# EAGLE design ACC-MB-R0 (EAGLE 9.1.3)

## Sheet 1 of 6
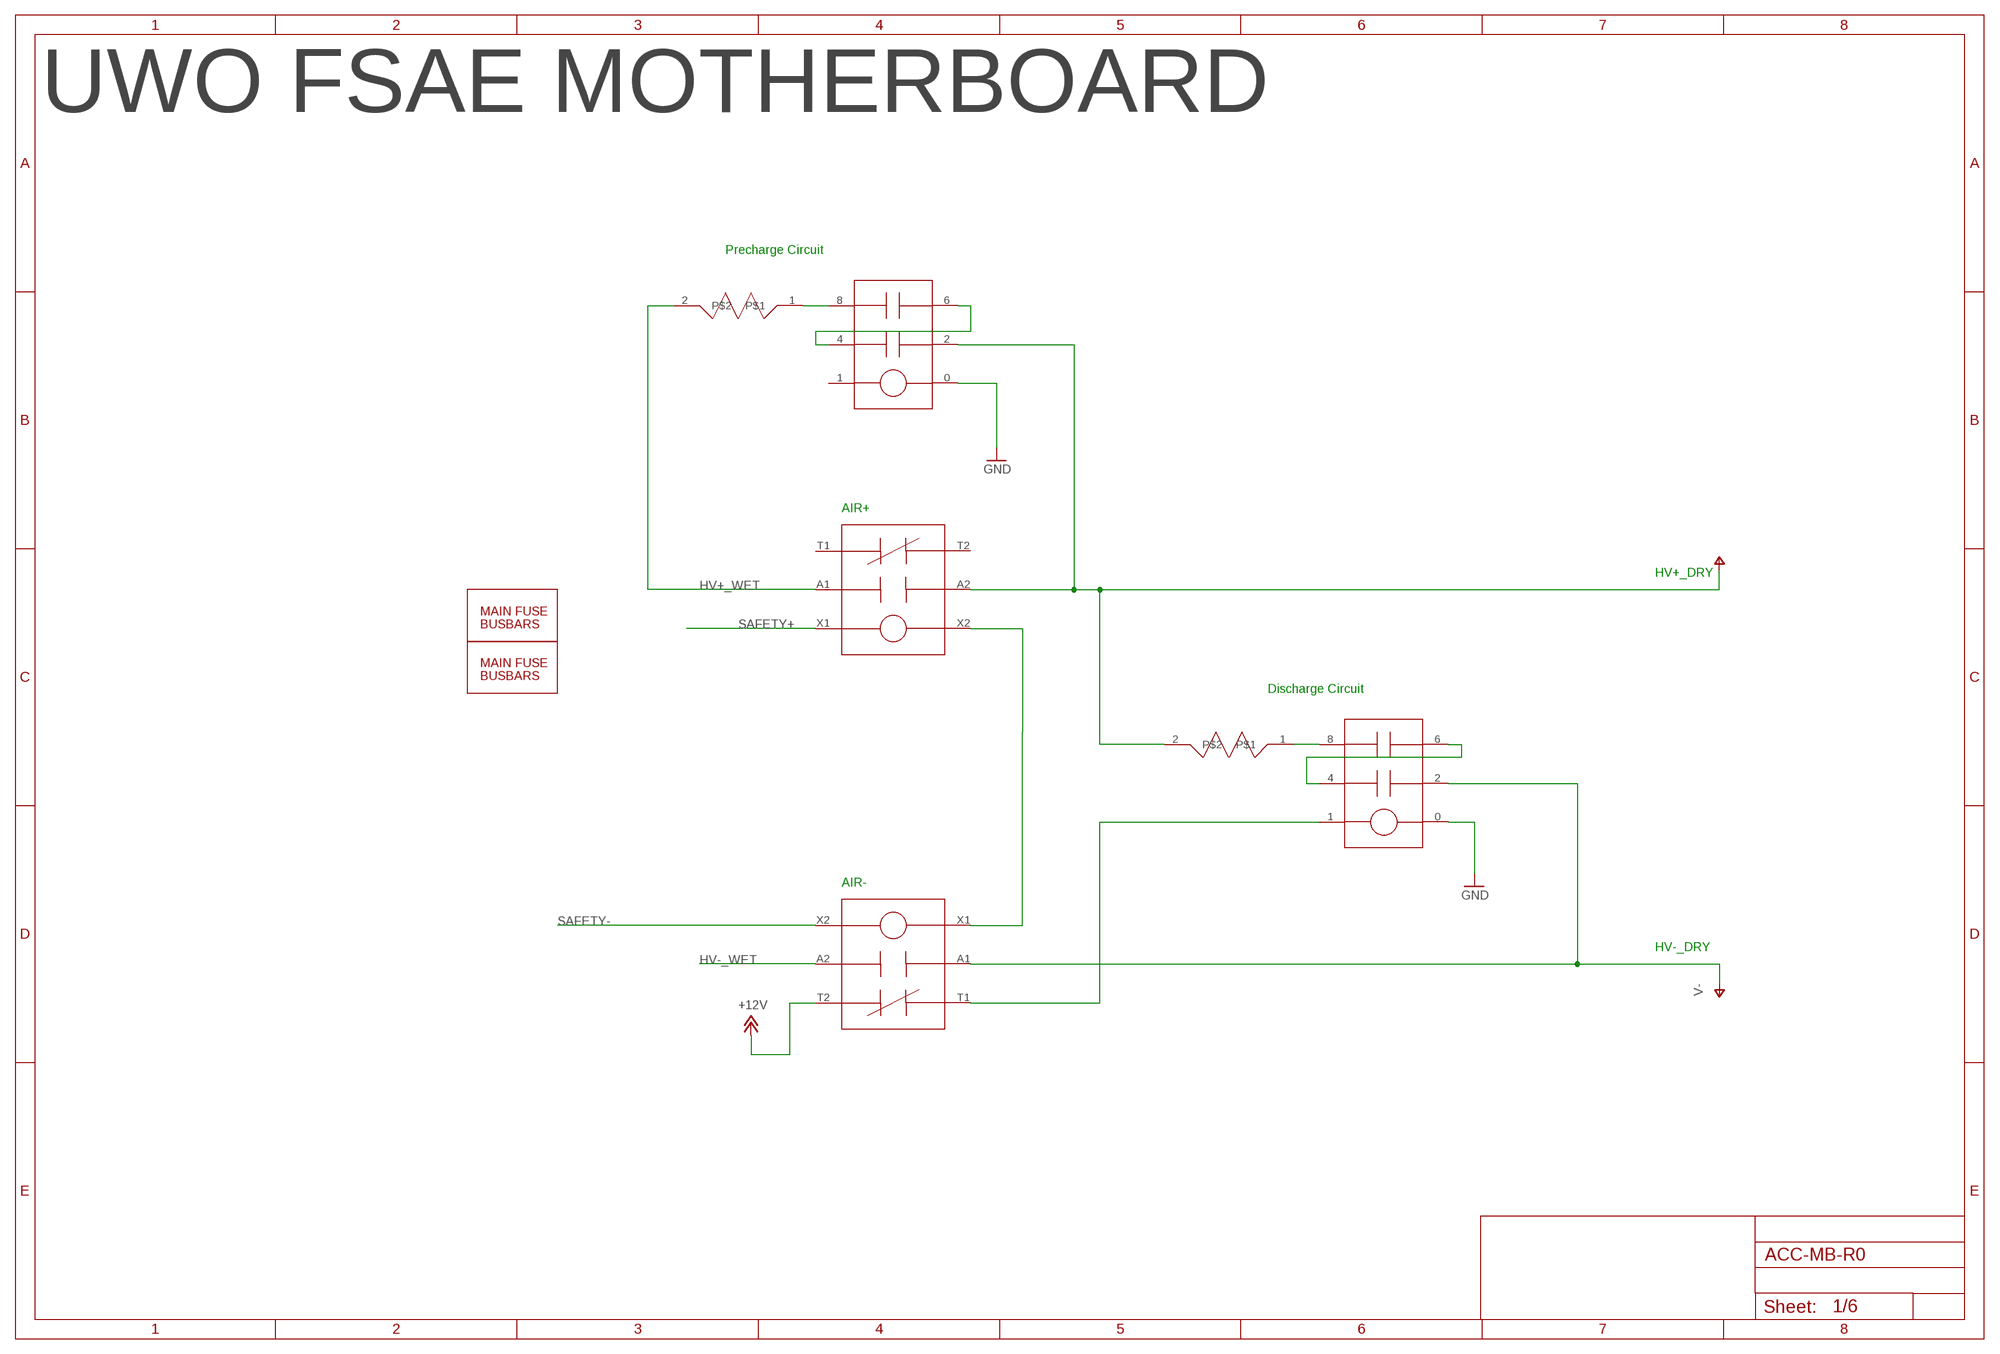
[diagram p0: schematic, sheet 1]

### Parts
U$1  G7L  [G7L]
U$4  TO247RESISTORHEATINK  [_CUSTOM_TO-247-2V]
U$24  FUSE_HOLDER  [FUSE_HOLDER]
U$31  GV224  [GV224]
U$32  GV224  [GV224]
U$33  FUSE_HOLDER  [FUSE_HOLDER]
U$34  G7L  [G7L]
U$35  TO247RESISTORHEATINK  [_CUSTOM_TO-247-2V]

### Nets
+12V: U$32.T2 ; also sheet 3,4,6
GND: U$1.0 U$34.0 ; also sheet 3,4,6
HV+_WET: U$31.A1 U$35.2
HV-_WET: U$32.A2
N$21: U$34.8 U$35.1
N$23: U$34.4 U$34.6
N$24: U$1.1 U$32.T1
N$27: U$31.X2 U$32.X1
N$30: U$1.4 U$1.6
N$31: U$1.8 U$4.1
SAFETY+: U$31.X1
SAFETY-: U$32.X2
V+ [LV]: U$4.2 U$31.A2 U$34.2 ; also sheet 3,4
V- [LV]: U$1.2 U$32.A1 ; also sheet 3,4
Unconnected: U$31.T1 U$31.T2 U$34.1

### Notes on the sheet
- UWO FSAE MOTHERBOARD
- Precharge Circuit
- AIR+
- HV+_DRY
- Discharge Circuit
- AIR-
- HV-_DRY

## Sheet 2 of 6
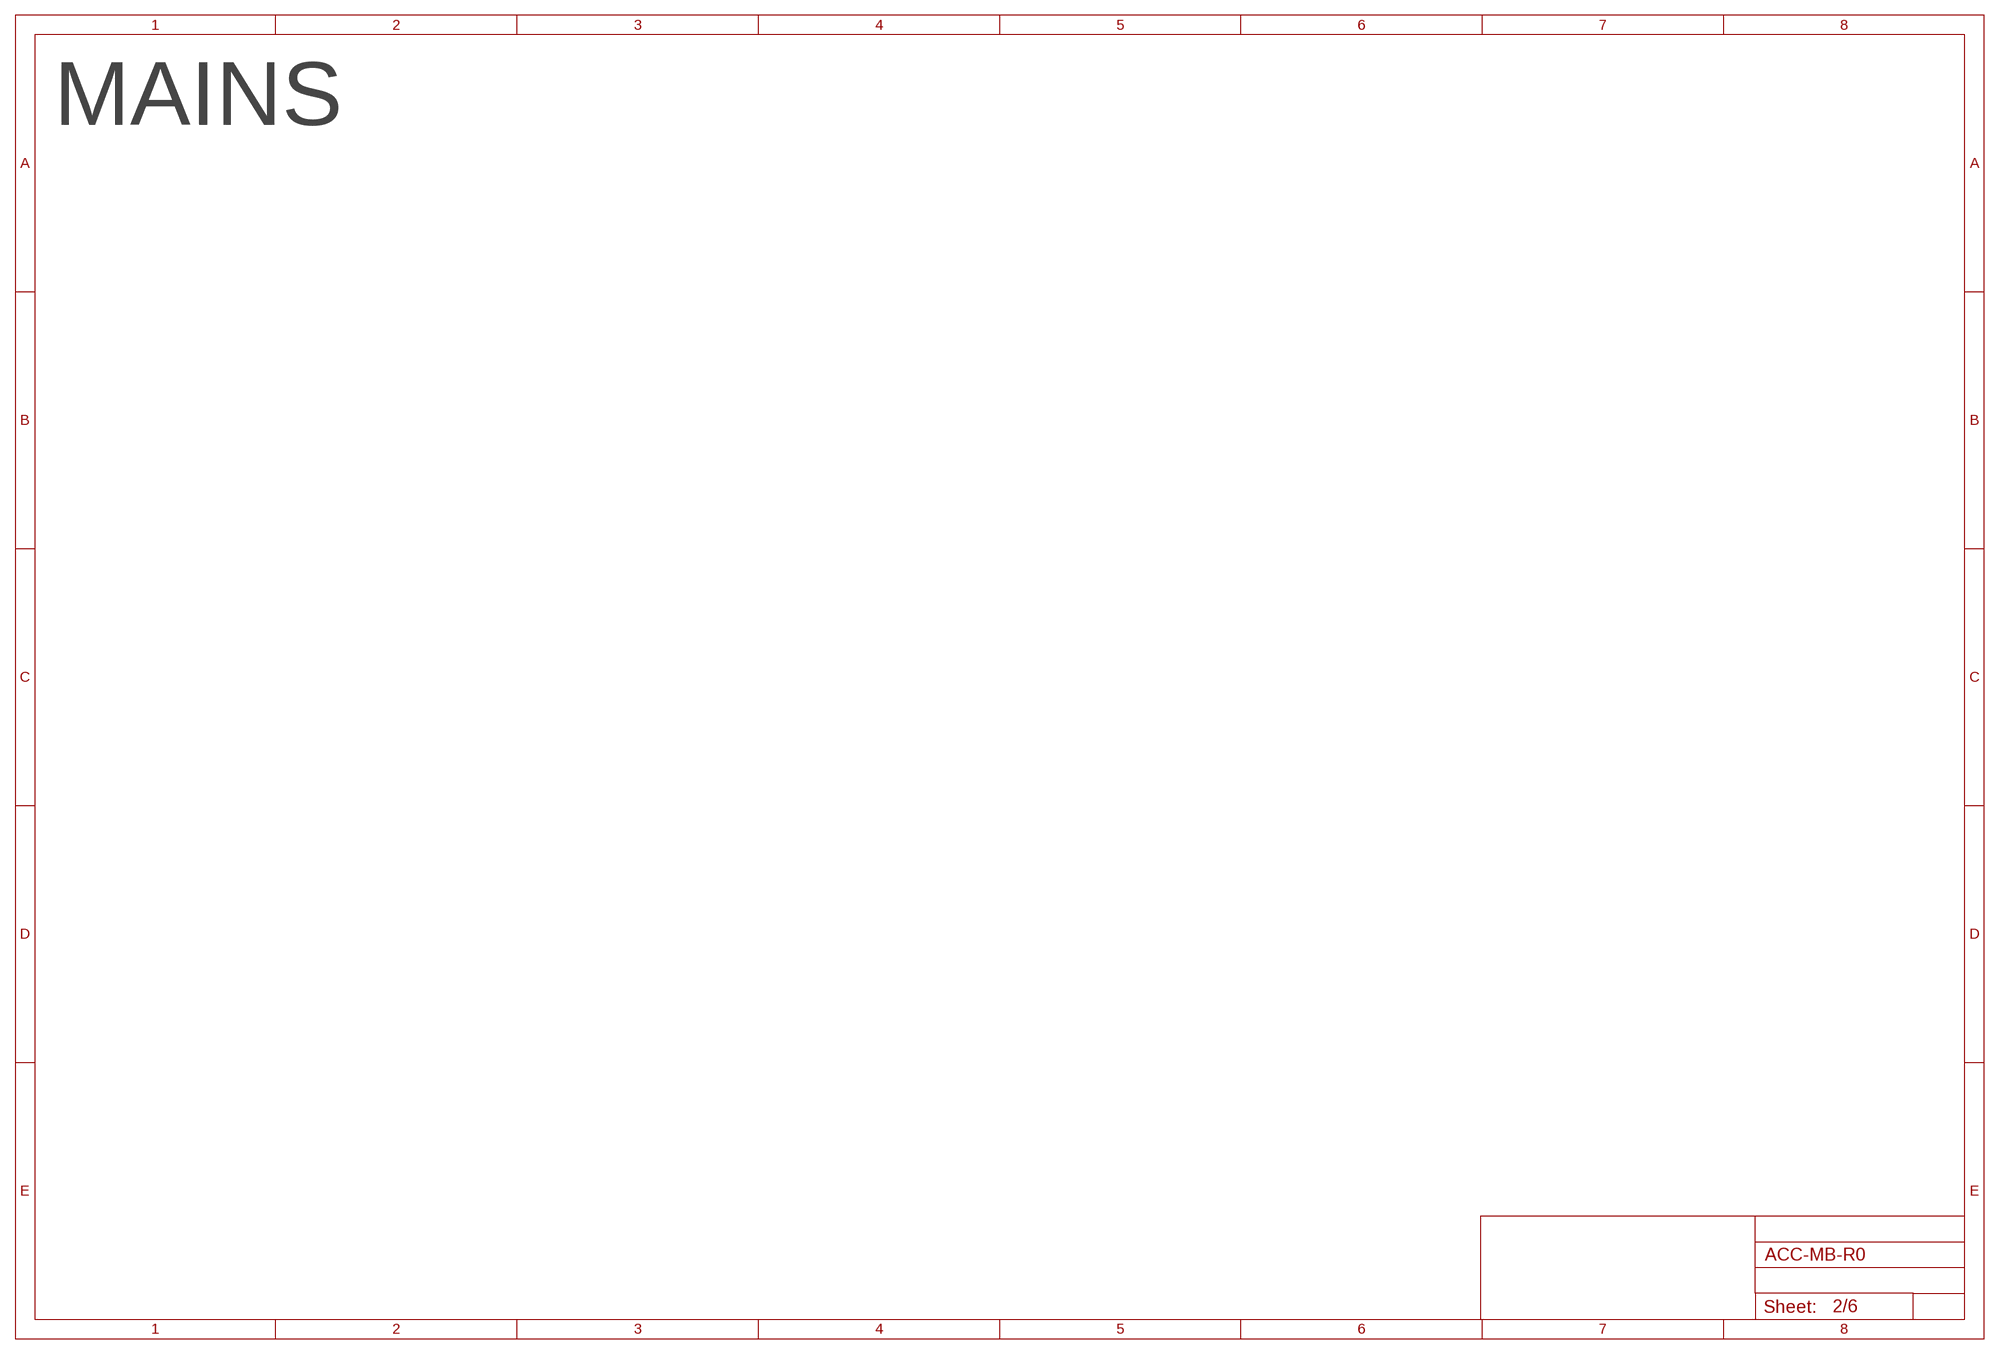
[diagram p1: schematic, sheet 2]

### Notes on the sheet
- MAINS

## Sheet 3 of 6
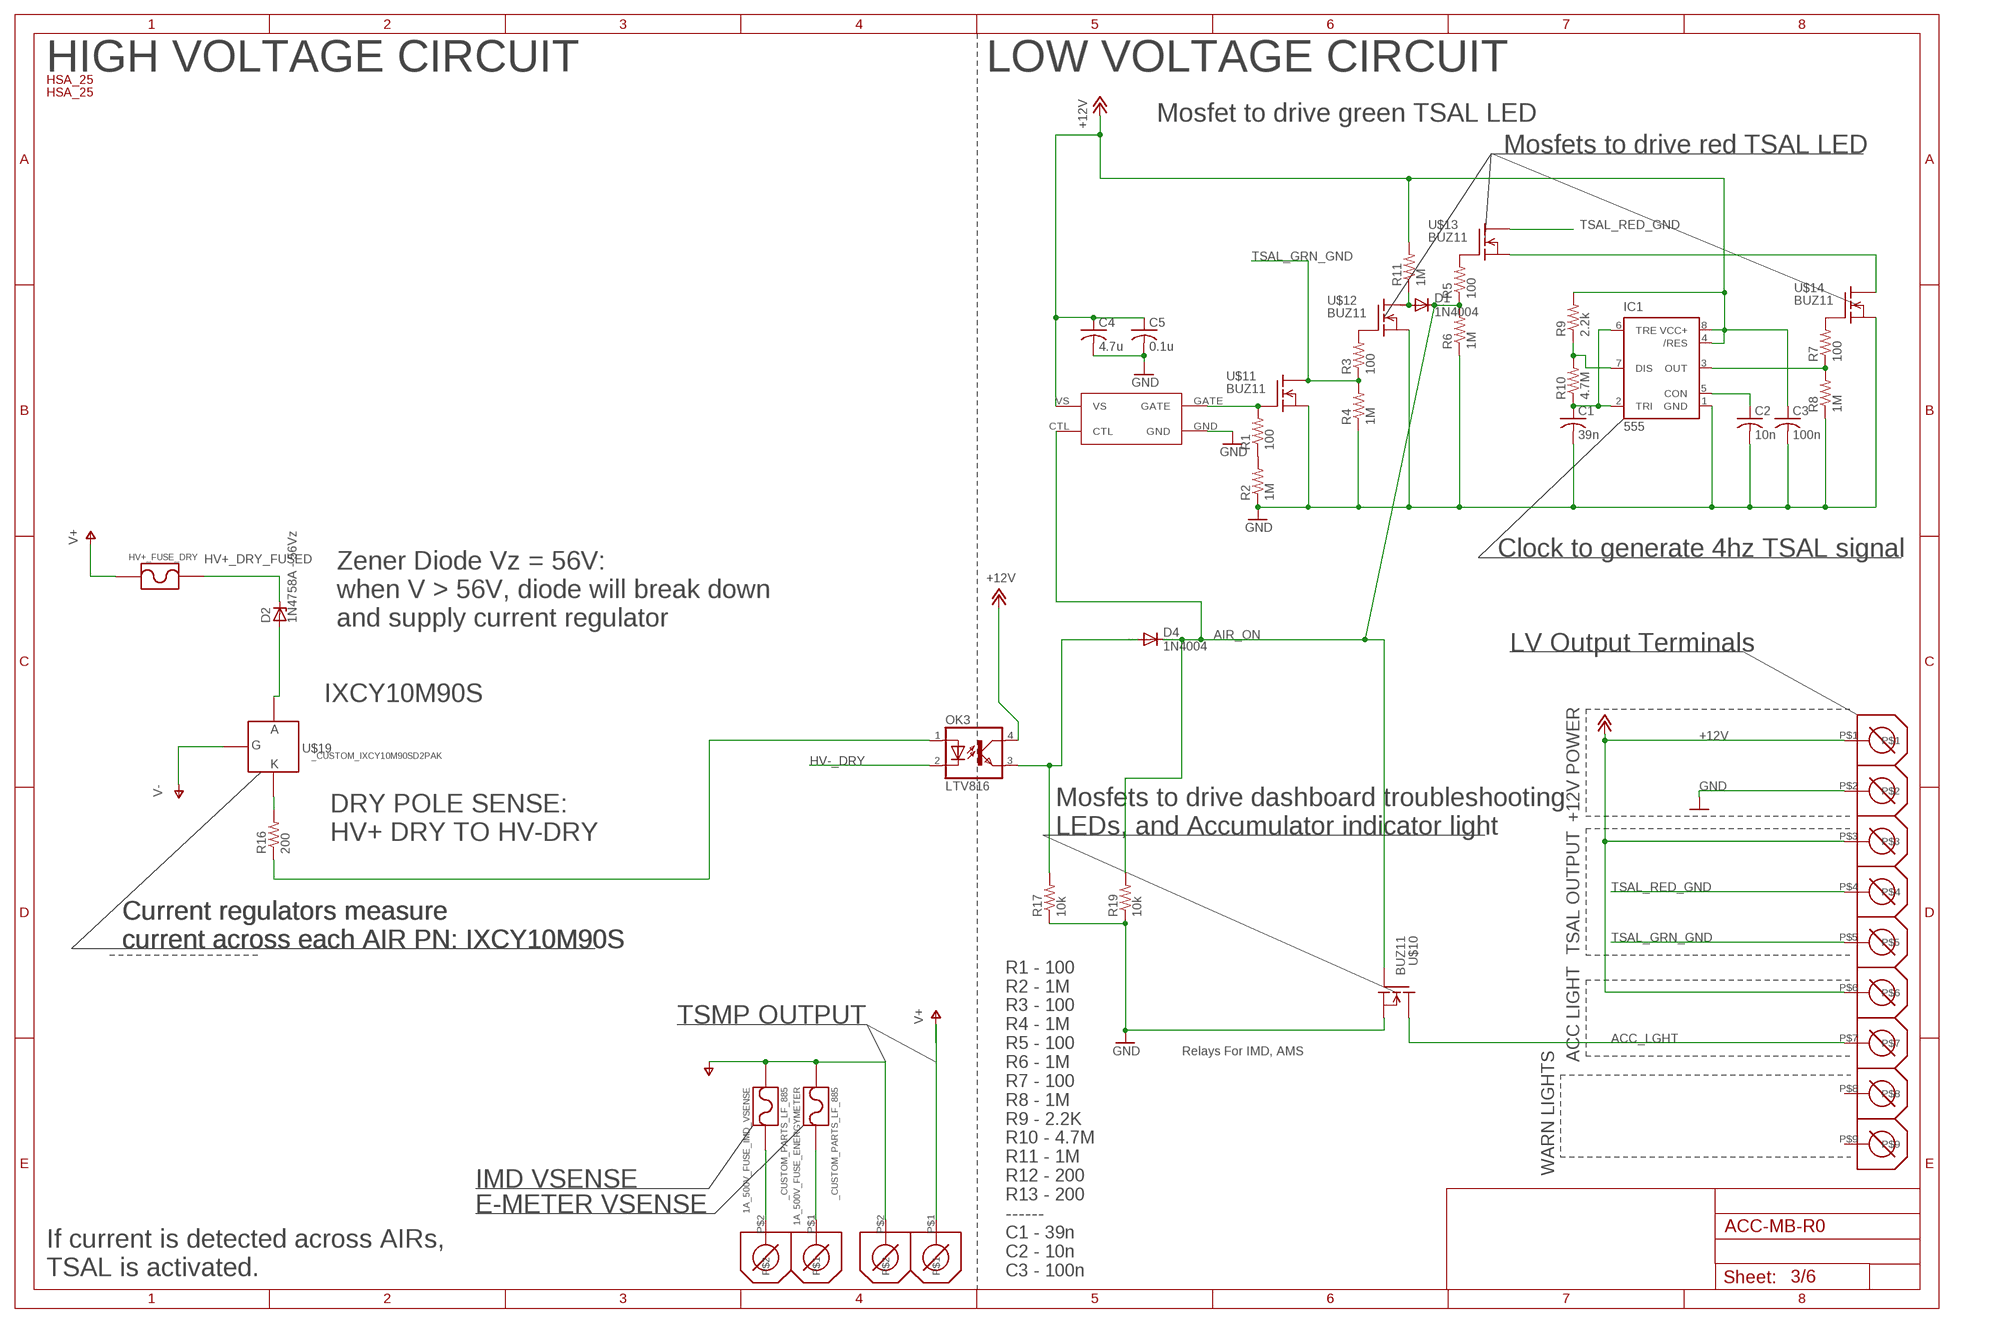
[diagram p2: schematic, sheet 3]

### Parts
1A_500V_FUSE_ENERGYMETER  _CUSTOM_PARTS_LF_885  [_CUSTOM_PARTS_LF_885]
1A_500V_FUSE_IMD_VSENSE  _CUSTOM_PARTS_LF_885  [_CUSTOM_PARTS_LF_885]
C1  39n  C-USC0805  [C0805]
C2  10n  C-USC0805  [C0805]
C3  100n  C-USC0805  [C0805]
C4  4.7u  C-USC0805  [C0805]
C5  0.1u  C-USC0805  [C0805]
D1  1N4004  [DO41-10]
D2  1N4758A - 56Vz  ZENER-DIODEZD-12.5  [ZDIO12.5]
D4  1N4004  [DO41-10]
HV+_FUSE_DRY  _CUSTOM_PARTS_LF_885  [_CUSTOM_PARTS_LF_885]
IC1  555  555P  [DIP08]
OK3  LTV816  [DIL04]
R1  100  R-US_R0805:1  [R0805:1]
R2  1M  R-US_R0805:1  [R0805:1]
R3  100  R-US_R0805:1  [R0805:1]
R4  1M  R-US_R0805:1  [R0805:1]
R5  100  R-US_R0805:1  [R0805:1]
R6  1M  R-US_R0805:1  [R0805:1]
R7  100  R-US_R0805:1  [R0805:1]
R8  1M  R-US_R0805:1  [R0805:1]
R9  2.2k  R-US_R0805:1  [R0805:1]
R10  4.7M  R-US_R0805:1  [R0805:1]
R11  1M  R-US_R0805:1  [R0805:1]
R16  200  R-US_R2010  [R2010]
R17  10k  R-US_R0805:1  [R0805:1]
R19  10k  R-US_R0805:1  [R0805:1]
U$2  HSA25  [HSA_25_FOOT]
U$3  HSA25  [HSA_25_FOOT]
U$7  PHOENIX_1725724  [1725724_FOOT]
U$10  BUZ11  [TO220]
U$11  BUZ11  [TO220]
U$12  BUZ11  [TO220]
U$13  BUZ11  [TO220]
U$14  BUZ11  [TO220]
U$15  MIC4417  [PDM_2019_REVB_MIC4416YM4-TR]
U$16  DCDC_PARTS_282838-2_TE  [DCDC_PARTS_282838-2_FOOT]
U$17  DCDC_PARTS_282838-2_TE  [DCDC_PARTS_282838-2_FOOT]
U$19  _CUSTOM_IXCY10M90SD2PAK  [TO228P991X238-3]

### Nets
+12V: C3.1 C4.1 C5.1 IC1.4(/RES) IC1.8(VCC+) OK3.4(COL) R9.2 R11.2 U$7.P$1 U$7.P$3 U$7.P$6 U$15.VS ; also sheet 1,4,6
ACC_LGHT: U$7.P$7 U$10.2(D)
AIR_ON: D1.C D4.C R5.1 R6.2 R19.2 U$10.1(G) U$15.CTL
GND: C1.2 C2.2 C3.2 C4.2 C5.2 IC1.1(GND) R2.1 R4.1 R6.1 R8.1 R17.1 R19.1 U$7.P$2 U$10.3(S) U$11.3(S) U$12.3(S) U$14.3(S) U$15.GND ; also sheet 1,4,6
HV+_DRY_FUSED [LV]: D2.C HV+_FUSE_DRY.P$1
HV-_DRY [LV]: OK3.2(C)
N$1: R1.1 R2.2
N$2: R1.2 U$11.1(G) U$15.GATE
N$3: R3.2 U$12.1(G)
N$4: C2.1 IC1.5(CON)
N$5: IC1.7(DIS) R9.1 R10.2
N$6: R5.2 U$13.1(G)
N$7: R7.2 U$14.1(G)
N$8: IC1.3(OUT) R7.1 R8.2
N$9: C1.1 IC1.2(TRI) IC1.6(TRE) R10.1
N$10: D2.A U$19.3(A)
N$13: U$13.3(S) U$14.2(D)
N$14: D4.A OK3.3(EMIT) R17.2
N$15: D1.A R11.1 U$12.2(D)
N$16: R16.2 U$19.2(K)
N$18 [LV]: 1A_500V_FUSE_IMD_VSENSE.P$2 U$17.P$2
N$19 [LV]: 1A_500V_FUSE_ENERGYMETER.P$2 U$17.P$1
N$22: OK3.1(A) R16.1
TSAL_GRN_GND: R3.1 R4.2 U$7.P$5 U$11.2(D)
TSAL_RED_GND: U$7.P$4 U$13.2(D)
V+ [LV]: HV+_FUSE_DRY.P$2 U$16.P$1 ; also sheet 1,4
V- [LV]: 1A_500V_FUSE_ENERGYMETER.P$1 1A_500V_FUSE_IMD_VSENSE.P$1 U$16.P$2 U$19.1(G) ; also sheet 1,4
Unconnected: U$7.P$8 U$7.P$9

### Notes on the sheet
- HIGH VOLTAGE CIRCUIT | LOW VOLTAGE CIRCUIT
- Mosfet to drive green TSAL LED
- Mosfets to drive red TSAL LED
- Clock to generate 4hz TSAL signal
- Zener Diode Vz = 56V: 
  when V > 56V, diode will break down 
  and supply current regulator
- LV Output Terminals
- IXCY10M90S
- +12V POWER
- Mosfets to drive dashboard troubleshooting
  LEDs, and Accumulator indicator light
- DRY POLE SENSE:
  HV+ DRY TO HV-DRY
- Current regulators measure 
  current across each AIR PN: IXCY10M90S
- Current regulators measure 
  current across each AIR PN: IXCY10M90S
- Current regulators measure 
  current across each AIR PN: IXCY10M90S
- TSAL OUTPUT
- TSMP OUTPUT
- Relays For IMD, AMS
- ACC LIGHT
- WARN LIGHTS
- IMD VSENSE
- E-METER VSENSE
- If current is detected across AIRs, 
  TSAL is activated.
- R1 - 100
  R2 - 1M
  R3 - 100
  R4 - 1M
  R5 - 100
  R6 - 1M
  R7 - 100
  R8 - 1M
  R9 - 2.2K
  R10 - 4.7M
  R11 - 1M
  R12 - 200
  R13 - 200
  ------
  C1 - 39n
  C2 - 10n
  C3 - 100n

## Sheet 4 of 6
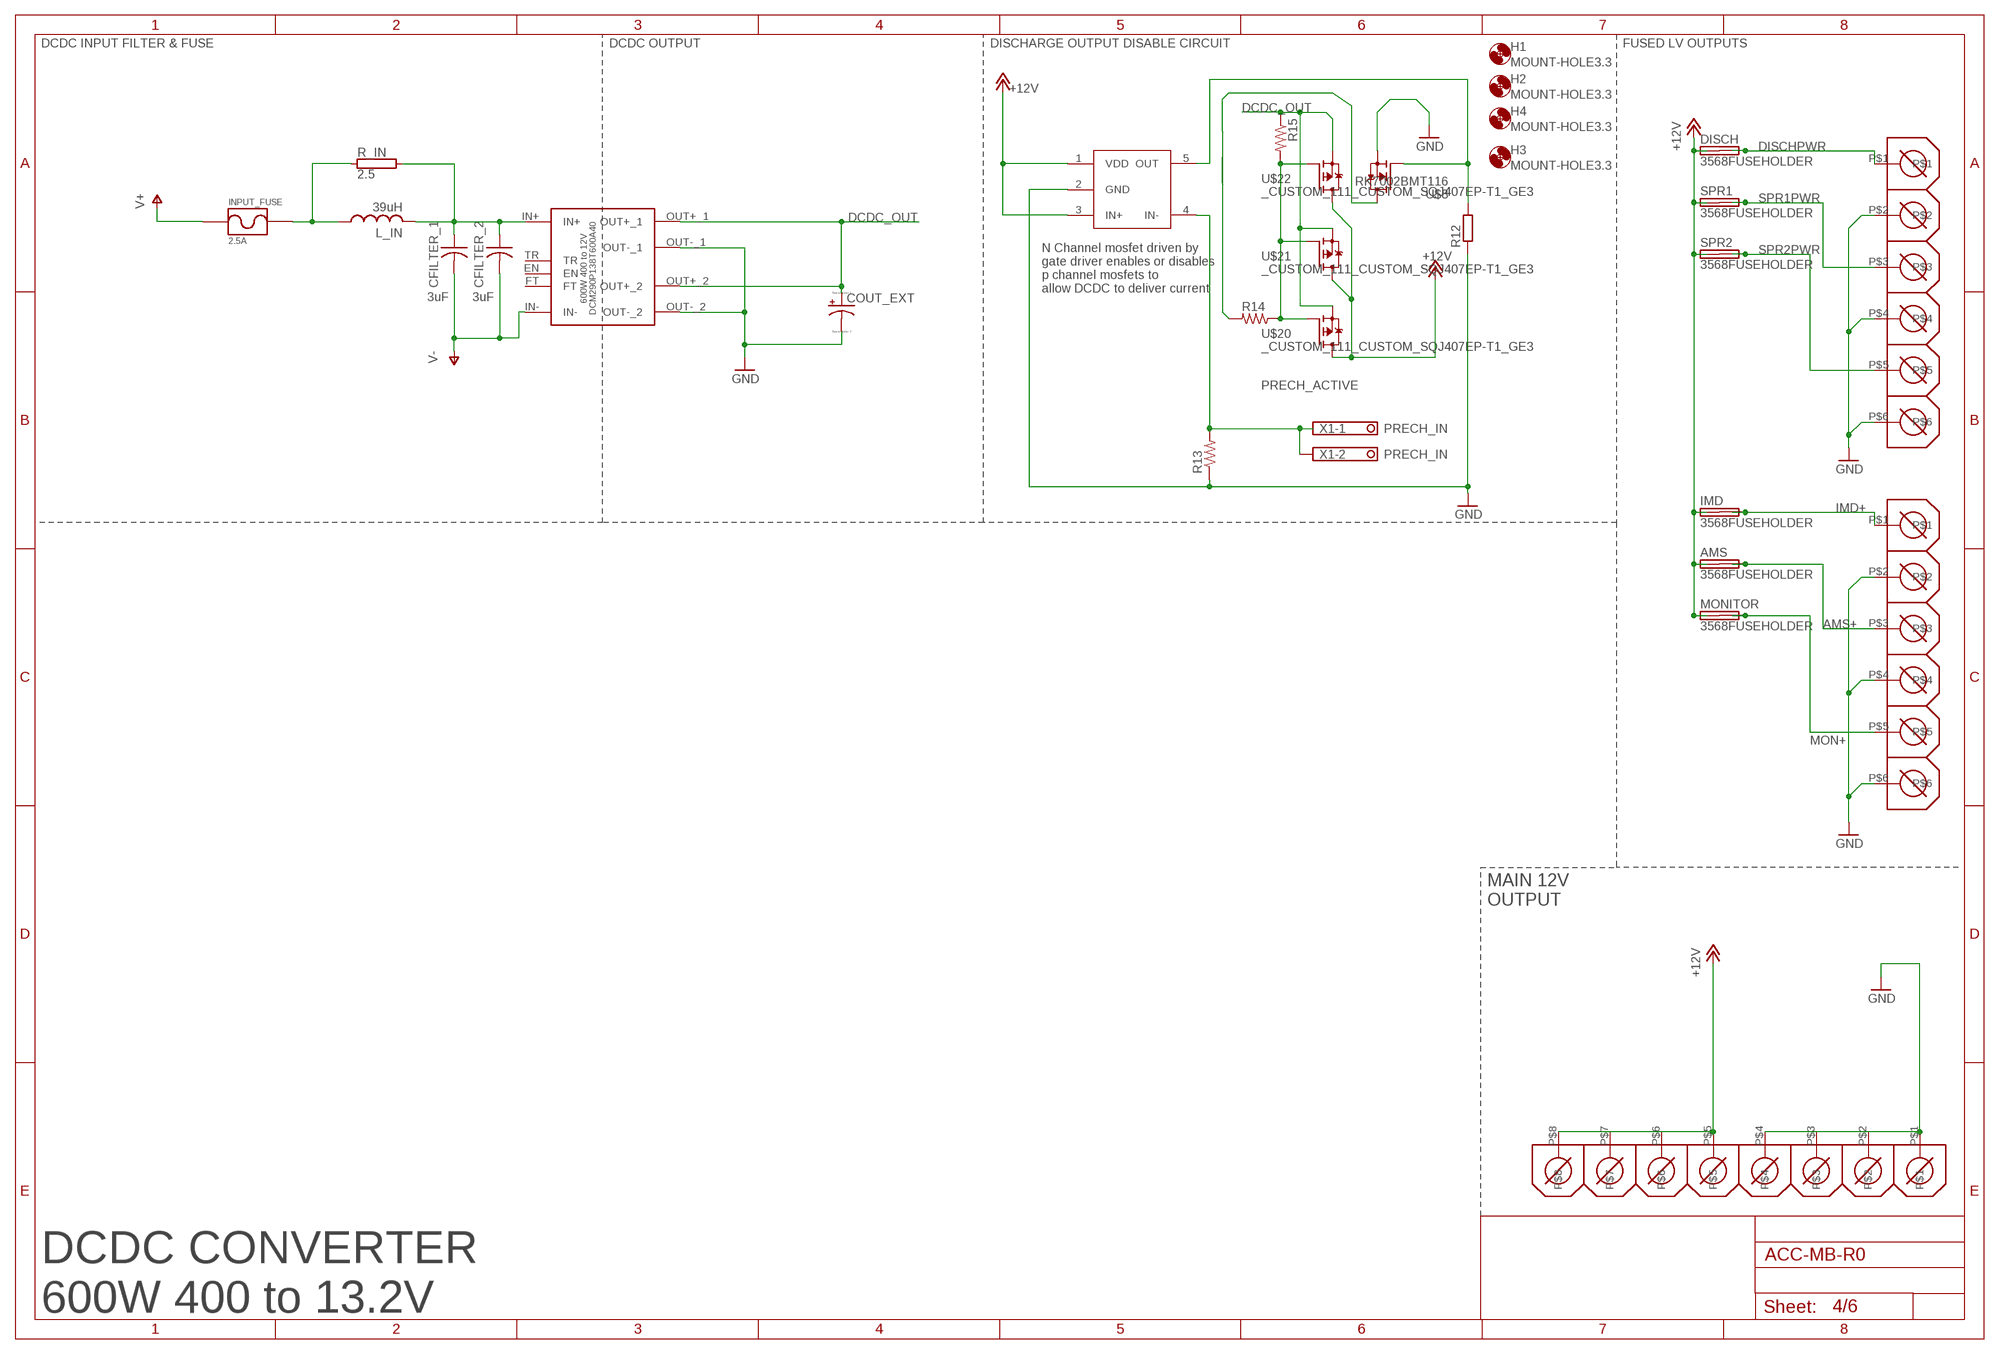
[diagram p3: schematic, sheet 4]

### Parts
AMS  3568FUSEHOLDER  [3568]
CFILTER_1  3uF  B58035U5305M062  [CERALINK_FA3]
CFILTER_2  3uF  B58035U5305M062  [CERALINK_FA3]
COUT_EXT  CPOL-USE7.5-16  [E7,5-16]
DCM290P138T600A40  600W 400 to 12V  VICOR_CHIP_WITH_HEATSINK  [VICOR_CHIP_HEATSINK]
DISCH  3568FUSEHOLDER  [3568]
H1  MOUNT-HOLE3.3  [3,3]
H2  MOUNT-HOLE3.3  [3,3]
H3  MOUNT-HOLE3.3  [3,3]
H4  MOUNT-HOLE3.3  [3,3]
IMD  3568FUSEHOLDER  [3568]
INPUT_FUSE  2.5A  _CUSTOM_PARTS_LF_885  [_CUSTOM_PARTS_LF_885]
L_IN  39uH  SRP1770TA-390M  [L_1510_NONSTANDARD]
MONITOR  3568FUSEHOLDER  [3568]
R12  R-EU_R0805  [R0805]
R13  R-US_R0805  [R0805]
R14  R-US_R0805  [R0805]
R15  R-US_R0805  [R0805]
R_IN  2.5  RMG100-V  [TO-247-2V]
SPR1  3568FUSEHOLDER  [3568]
SPR2  3568FUSEHOLDER  [3568]
U$5  1935200_PHOENIX  [1777587_FOOT]
U$6  1935200_PHOENIX  [1777587_FOOT]
U$8  RK7002BMT116  [SOT23]
U$9  1777600_PHOENIX  [1777600_FOOT]
U$18  UCC27511AQDBVRQ1  [SOT23-5L]
U$20  _CUSTOM_111_CUSTOM_SQJ407EP-T1_GE3  [_CUSTOM_111_CUSTOM_TRANS_SIRA90DP-T1-GE3]
U$21  _CUSTOM_111_CUSTOM_SQJ407EP-T1_GE3  [_CUSTOM_111_CUSTOM_TRANS_SIRA90DP-T1-GE3]
U$22  _CUSTOM_111_CUSTOM_SQJ407EP-T1_GE3  [_CUSTOM_111_CUSTOM_TRANS_SIRA90DP-T1-GE3]
X1  PRECH_IN  1751248  [1751248]

### Nets
+12V: AMS.L1(1A) AMS.L2(1B) DISCH.L1(1A) DISCH.L2(1B) IMD.L1(1A) IMD.L2(1B) MONITOR.L1(1A) MONITOR.L2(1B) SPR1.L1(1A) SPR1.L2(1B) SPR2.L1(1A) SPR2.L2(1B) U$9.P$5 U$9.P$6 U$9.P$7 U$9.P$8 U$18.1(VDD) U$18.3(IN+) U$20.5(D) U$21.5(D) U$22.5(D) ; also sheet 1,3,6
AMS+: AMS.R1(2A) AMS.R2(2B) U$5.P$3
DCDC_OUT: COUT_EXT.+ DCM290P138T600A40.OUT+_1 DCM290P138T600A40.OUT+_2 R15.1 U$20.1(S) U$20.2(S) U$20.3(S) U$21.1(S) U$21.2(S) U$21.3(S) U$22.1(S) U$22.2(S) U$22.3(S)
DISCHPWR: DISCH.R1(2A) DISCH.R2(2B) U$6.P$1
GND: COUT_EXT.- DCM290P138T600A40.OUT-_1 DCM290P138T600A40.OUT-_2 R12.1 R13.1 U$5.P$2 U$5.P$4 U$5.P$6 U$6.P$2 U$6.P$4 U$6.P$6 U$8.2(S) U$9.P$1 U$9.P$2 U$9.P$3 U$9.P$4 U$18.2(GND) ; also sheet 1,3,6
IMD+: IMD.R1(2A) IMD.R2(2B) U$5.P$1
MON+: MONITOR.R1(2A) MONITOR.R2(2B) U$5.P$5
N$11: R12.2 U$8.1(G) U$18.5(OUT)
N$12 [LV]: CFILTER_1.P$1 CFILTER_2.P$1 DCM290P138T600A40.IN+ L_IN.P$2 R_IN.2
N$17: R14.2 U$8.3(D)
N$20: R14.1 R15.2 U$20.4(G) U$21.4(G) U$22.4(G)
PRECH_ACTIVE: R13.2 U$18.4(IN-) X1.1 X1.2
SPR1PWR: SPR1.R1(2A) SPR1.R2(2B) U$6.P$3
SPR2PWR: SPR2.R1(2A) SPR2.R2(2B) U$6.P$5
V+ [LV]: INPUT_FUSE.P$1 ; also sheet 1,3
V+_FUSED [LV]: INPUT_FUSE.P$2 L_IN.P$1 R_IN.1
V- [LV]: CFILTER_1.P$2 CFILTER_2.P$2 DCM290P138T600A40.IN- ; also sheet 1,3
Unconnected: DCM290P138T600A40.EN DCM290P138T600A40.FT DCM290P138T600A40.TR

### Notes on the sheet
- DCDC INPUT FILTER & FUSE | DCDC OUTPUT | DISCHARGE OUTPUT DISABLE CIRCUIT | FUSED LV OUTPUTS
- N Channel mosfet driven by 
  gate driver enables or disables 
  p channel mosfets to 
  allow DCDC to deliver current
- MAIN 12V
  OUTPUT
- DCDC CONVERTER 
  600W 400 to 13.2V

## Sheet 5 of 6
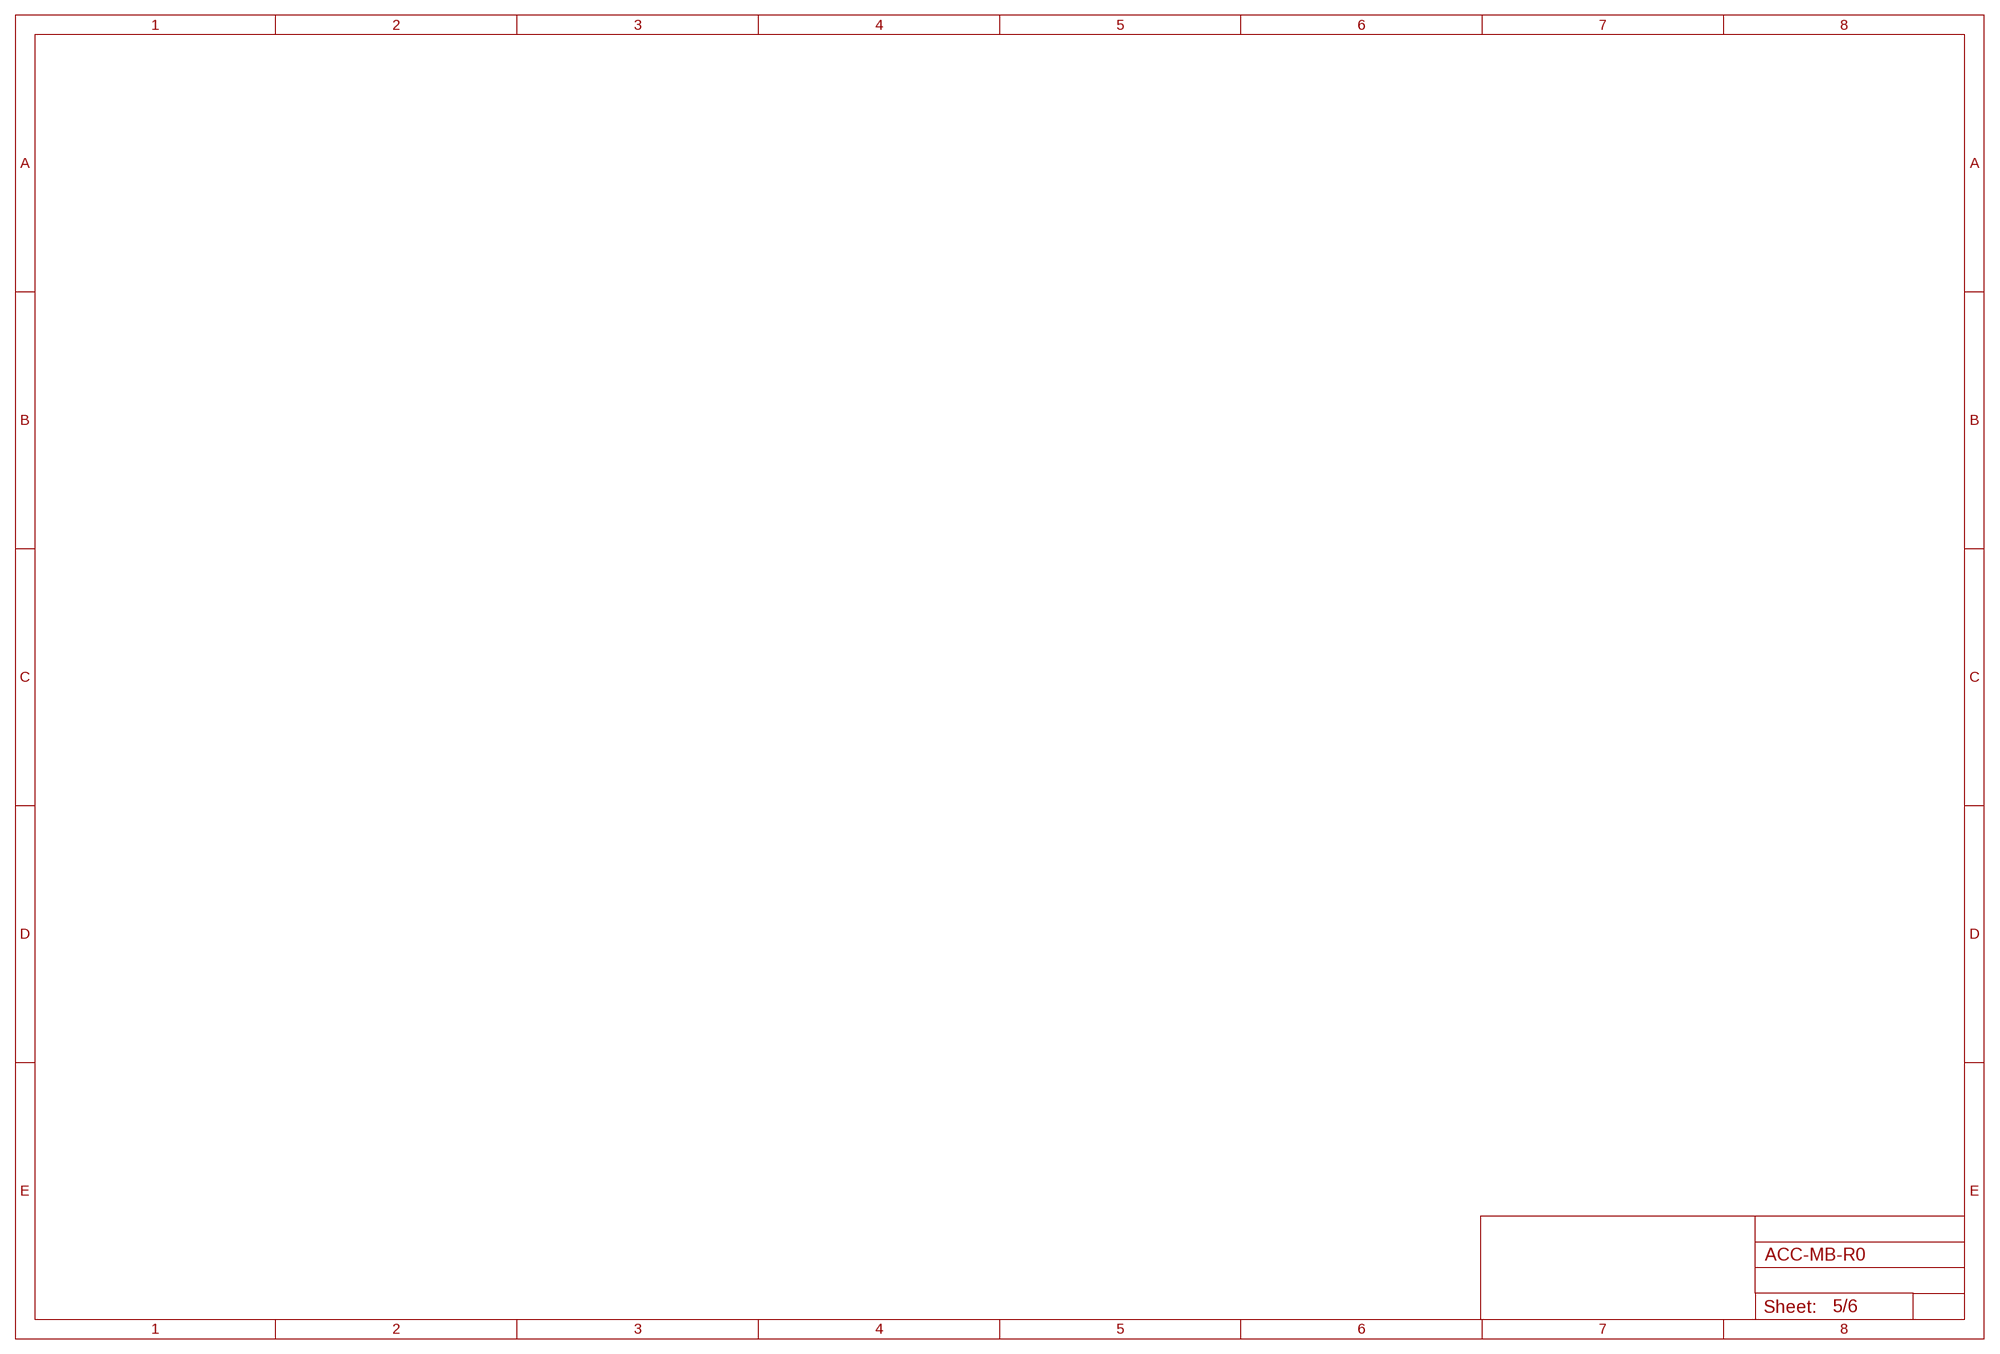
[diagram p4: schematic, sheet 5]

## Sheet 6 of 6
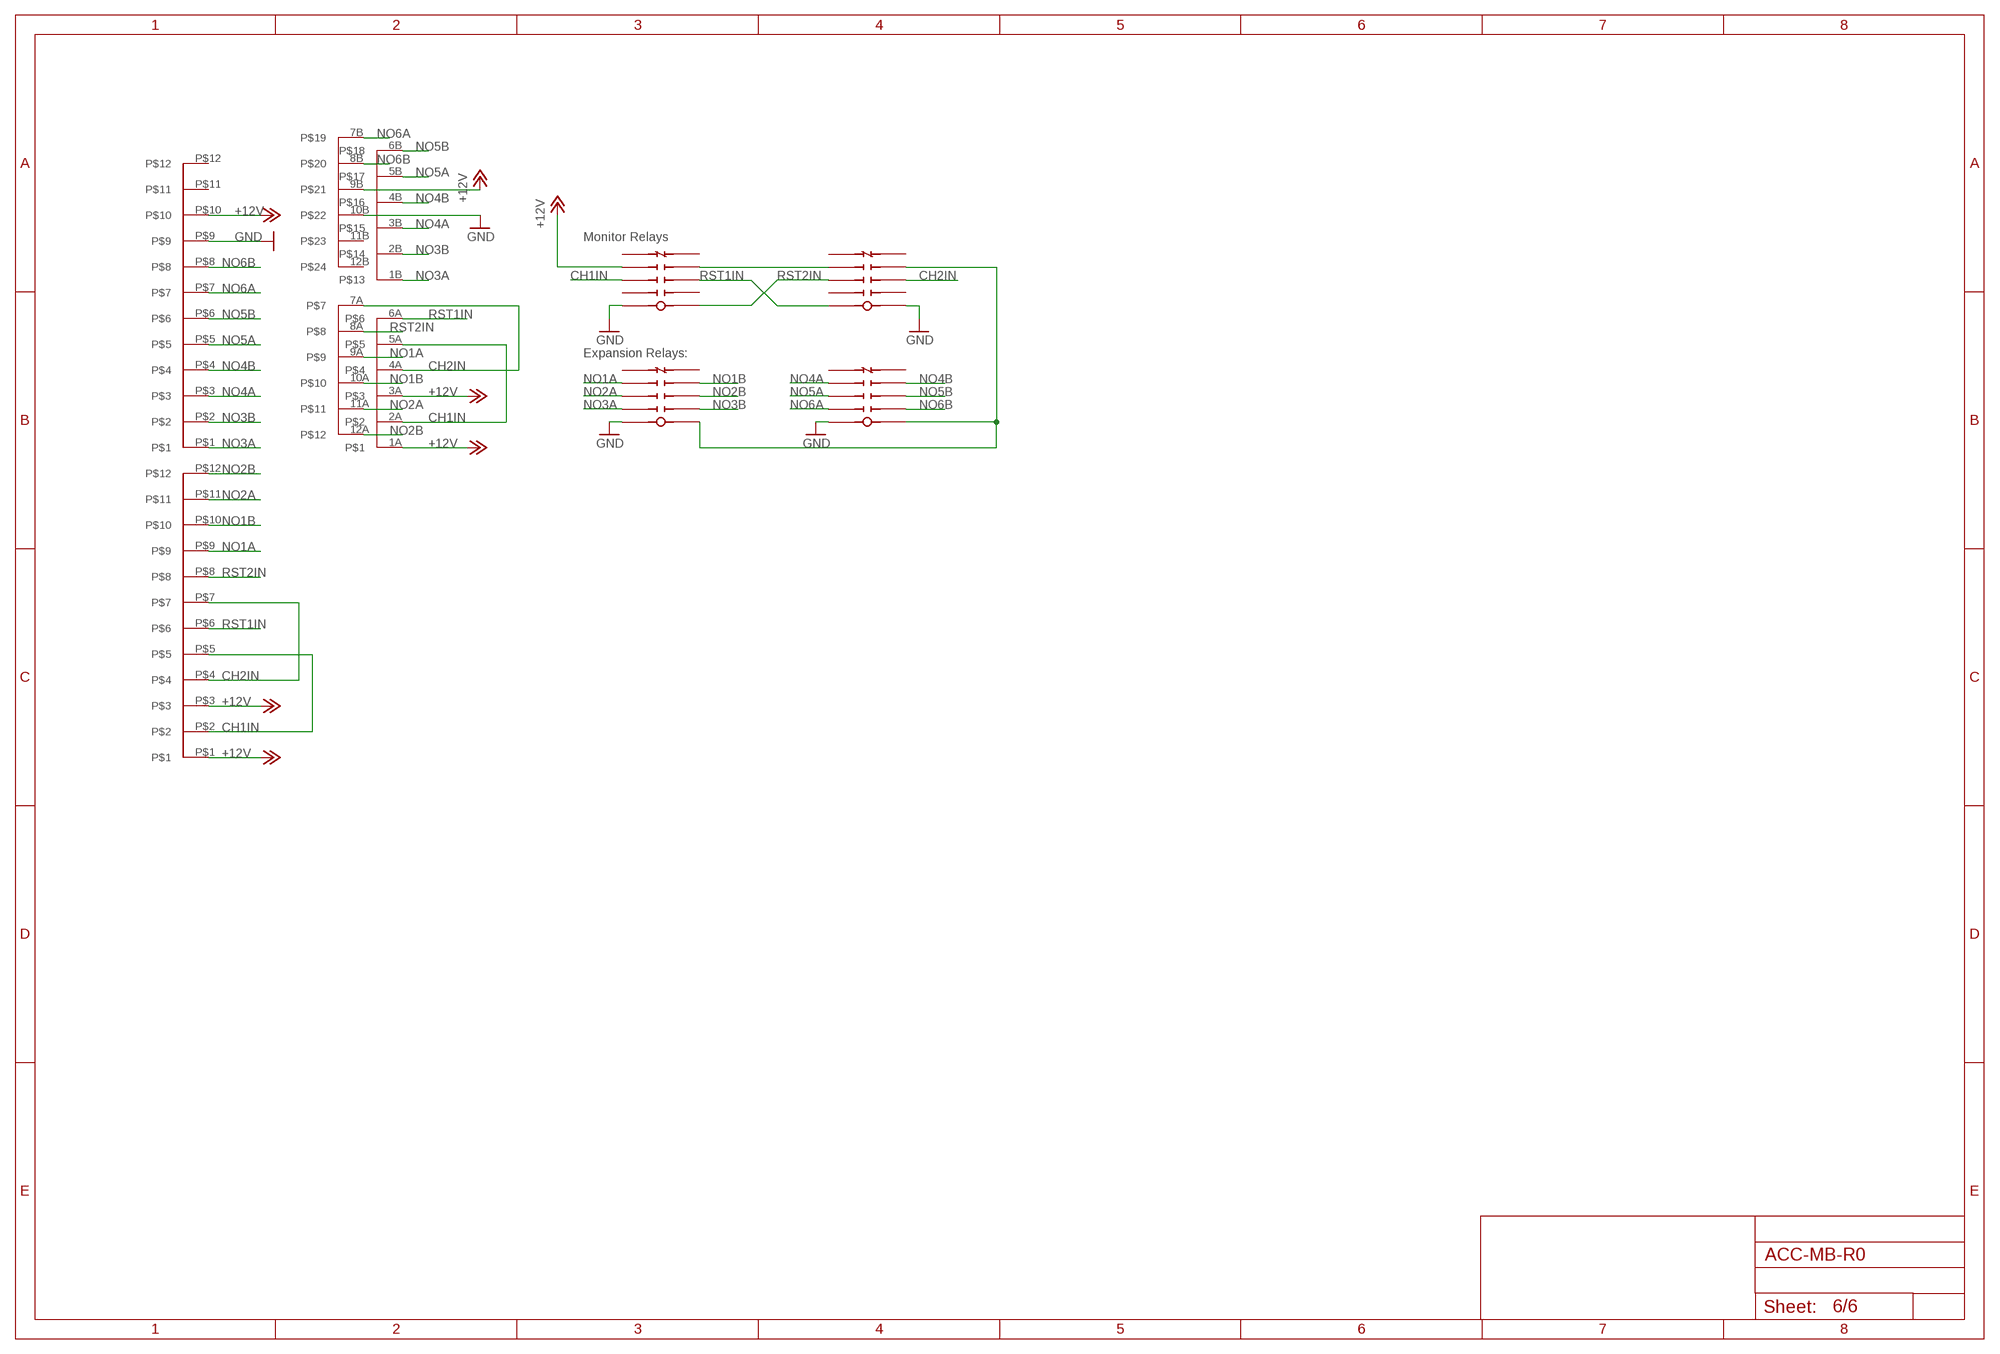
[diagram p5: schematic, sheet 6]

### Parts
U$23  1777642_PHOENIX  [1777642_FOOTPRINT]
U$25  1777642_PHOENIX  [1777642_FOOTPRINT]
U$26  DTM1312PA12BR008  [DE_12X2_PIN_HEADER]
U$27  SR4M4012_TE  [SR4M4012_FOOT]
U$28  SR4M4012_TE  [SR4M4012_FOOT]
U$29  SR4M4012_TE  [SR4M4012_FOOT]
U$30  SR4M4012_TE  [SR4M4012_FOOT]

### Nets
+12V: U$23.P$10 U$25.P$1 U$25.P$3 U$26.1A U$26.3A U$26.9B U$27.NOA3 ; also sheet 1,3,4
CH1IN: U$25.P$2 U$25.P$5 U$26.2A U$26.5A U$27.NOA2
CH2IN: U$25.P$4 U$25.P$7 U$26.4A U$26.7A U$28.NOB2
GND: U$23.P$9 U$26.10B U$27.COIL+ U$28.COIL- U$29.COIL+ U$30.COIL+ ; also sheet 1,3,4
N$25: U$27.NOB3 U$28.NOA3
N$26: U$28.NOB3 U$29.COIL- U$30.COIL-
NO1A: U$25.P$9 U$26.9A U$29.NOA3
NO1B: U$25.P$10 U$26.10A U$29.NOB3
NO2A: U$25.P$11 U$26.11A U$29.NOA2
NO2B: U$25.P$12 U$26.12A U$29.NOB2
NO3A: U$23.P$1 U$26.1B U$29.NOA1
NO3B: U$23.P$2 U$26.2B U$29.NOB1
NO4A: U$23.P$3 U$26.3B U$30.NOA3
NO4B: U$23.P$4 U$26.4B U$30.NOB3
NO5A: U$23.P$5 U$26.5B U$30.NOA2
NO5B: U$23.P$6 U$26.6B U$30.NOB2
NO6A: U$23.P$7 U$26.7B U$30.NOA1
NO6B: U$23.P$8 U$26.8B U$30.NOB1
RST1IN: U$25.P$6 U$26.6A U$27.NOB2 U$28.COIL+
RST2IN: U$25.P$8 U$26.8A U$27.COIL- U$28.NOA2
Unconnected: U$23.P$11 U$23.P$12 U$26.11B U$26.12B U$27.NCA4 U$27.NCB4 U$27.NOA1 U$27.NOB1 U$28.NCA4 U$28.NCB4 U$28.NOA1 U$28.NOB1 U$29.NCA4 U$29.NCB4 U$30.NCA4 U$30.NCB4

### Notes on the sheet
- Monitor Relays
- Expansion Relays:

## Library data of the parts
1A_500V_FUSE_ENERGYMETER 1A_500V_FUSE_IMD_VSENSE HV+_FUSE_DRY INPUT_FUSE = ACC-MB-R0:_CUSTOM_PARTS_LF_885
AMS DISCH IMD MONITOR SPR1 SPR2 = ACC-MB-R0:3568FUSEHOLDER: 3568 20AMP 500VAC
C1-C5 = ACC-MB-R0:C-US: CAPACITOR, American symbol
CFILTER_1 CFILTER_2 = ACC-MB-R0:B58035U5305M062
COUT_EXT = ACC-MB-R0:CPOL-US: POLARIZED CAPACITOR, American symbol
D1 D4 = ACC-MB-R0:1N4004: DIODE general purpose rectifier, 1 A
D2 = ACC-MB-R0:ZENER-DIODE: Z-Diode
DCM290P138T600A40 = ACC-MB-R0:VICOR_CHIP_WITH_HEATSINK
H1-H4 = ACC-MB-R0:MOUNT-HOLE: MOUNTING HOLE with drill center marker
IC1 = ACC-MB-R0:555: General purpose bipolar Timer Datasheet <http://www.sparkfun.com/datasheets/Components/General/ne555.pdf> SparkFun Products SparkFun SparkPunk Sequencer Kit <https://www.sparkfun.com/products/12707> (KIT-12707) Storefront Component: 555 Timer <https://www.sparkfun.com/products/9273> (COM-09273) Two parts valid for production: VFP: IC-11930 (M7555 PTH) VFP: IC-09173 (555 PTH) - Preferred; PROD_ID: IC-09173; PROD_ID_ALT: IC-09173
L_IN = ACC-MB-R0:SRP1770TA-390M
OK3 = ACC-MB-R0:LTV816: OPTO COUPLER Source: LITEON, LTV816.pdf; OC_FARNELL: unknown; OC_NEWARK: unknown
R1-R11 R17 R19 = ACC-MB-R0:R-US_*?:1: RESISTOR, American symbol
R12 = ACC-MB-R0:R-EU_: RESISTOR, European symbol; SPICEPREFIX: R
R13-R16 = ACC-MB-R0:R-US_: RESISTOR, American symbol; SPICEPREFIX: R
R_IN = ACC-MB-R0:RMG100: TO-247 Power Resistor - RMG 100 Series Source: www.token.com.tw .. power-resistor-rmg100pdf; OC_FARNELL: unknown; OC_NEWARK: unknown
U$1 U$34 = ACC-MB-R0:G7L
U$2 U$3 = ACC-MB-R0:HSA25
U$4 U$35 = ACC-MB-R0:TO247RESISTORHEATINK
U$5 U$6 = ACC-MB-R0:1935200_PHOENIX
U$7 = ACC-MB-R0:PHOENIX_1725724
U$8 = ACC-MB-R0:RK7002BMT116
U$9 = ACC-MB-R0:1777600_PHOENIX
U$10-U$14 = ACC-MB-R0:BUZ11: N-Channel Enhancement MOSFET 50V; 30A; 0,040Ohm
U$15 = ACC-MB-R0:MIC4417; MPN: MIC4417
U$16 U$17 = ACC-MB-R0:DCDC_PARTS_282838-2_TE
U$18 = ACC-MB-R0:UCC27511AQDBVRQ1
U$19 = ACC-MB-R0:_CUSTOM_IXCY10M90S
U$20-U$22 = ACC-MB-R0:_CUSTOM_111_CUSTOM_SQJ407EP-T1_GE3
U$23 U$25 = ACC-MB-R0:1777642_PHOENIX
U$24 U$33 = ACC-MB-R0:FUSE_HOLDER
U$26 = ACC-MB-R0:DTM1312PA12BR008
U$27-U$30 = ACC-MB-R0:SR4M4012_TE
U$31 U$32 = ACC-MB-R0:GV224
X1 = ACC-MB-R0:1751248: MKDS 1/ 2-3,5 Printklemme Nennstrom: 10 A Bemessungsspannung: 160 V Raster: 3,5 mm Polzahl: 2 Montageart: Löten Anschlussart: Schraubanschluss Anschlussrichtung vom Leiter zur Platine: 0° Source: http://eshop.phoenixcontact.com .. 1751248.pdf; OC_FARNELL: unknown; OC_NEWARK: unknown

## Net classes
0 default: width 1 mm, clearance 0.152 mm
1 LV: clearance 0.001 mm

## Board
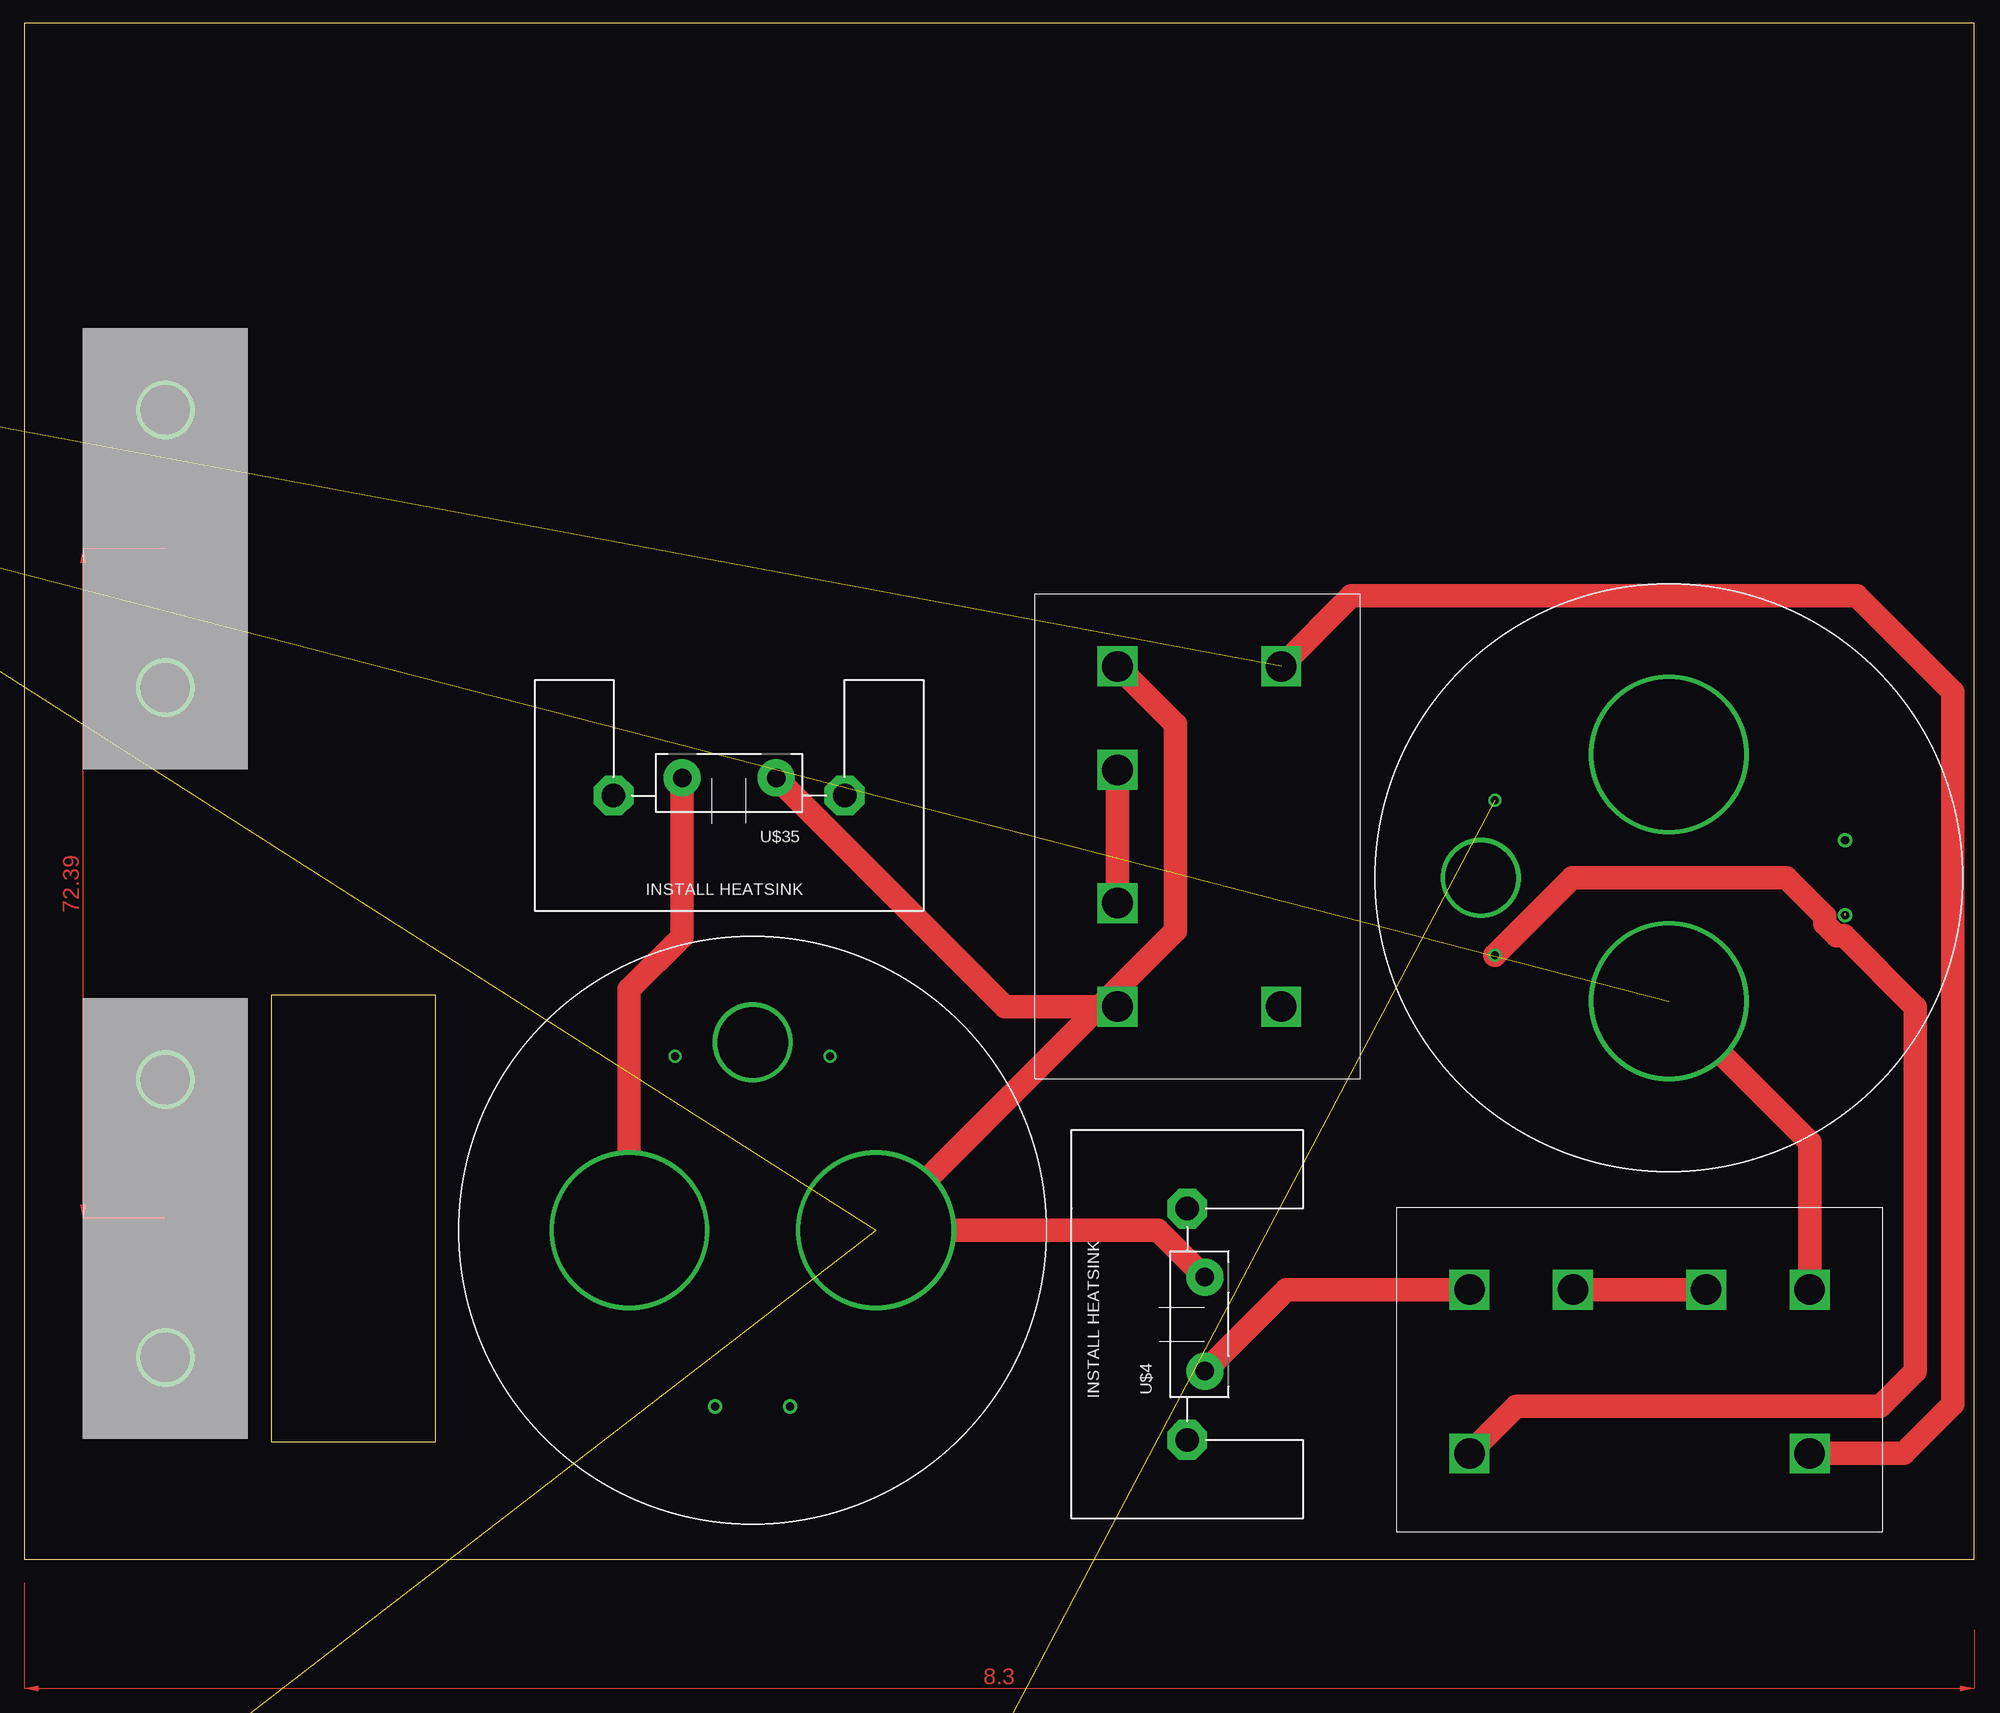
[diagram p6: board, top side]
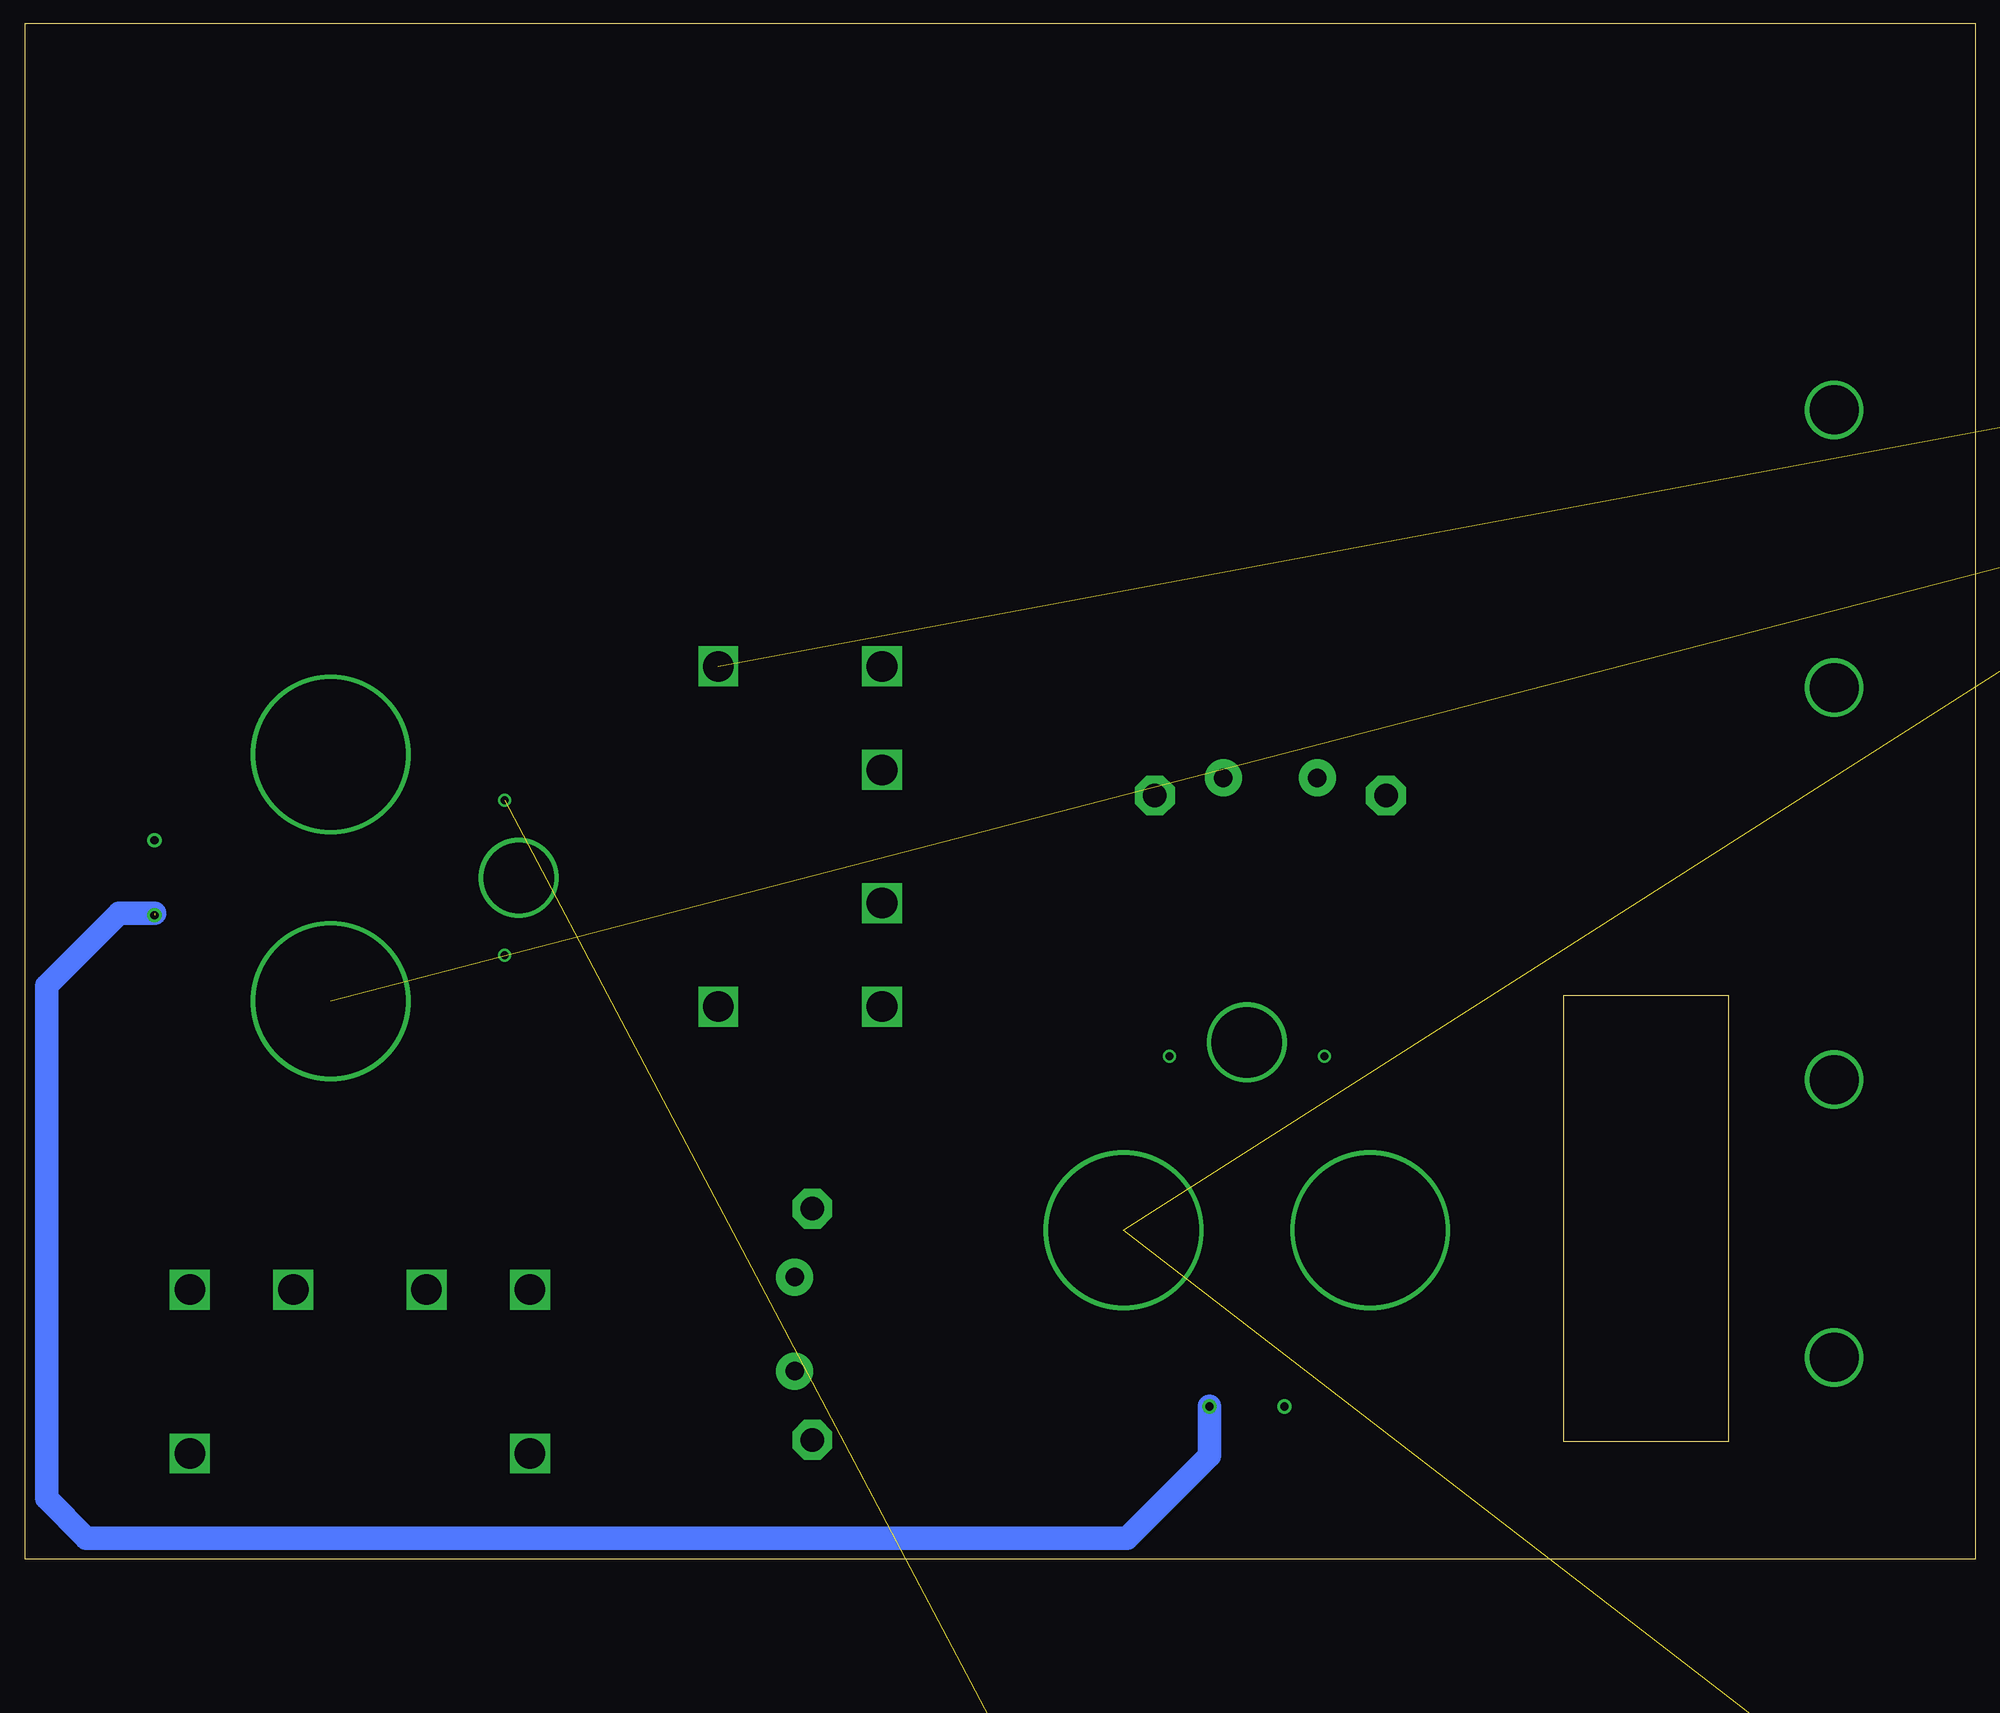
[diagram p7: board, bottom side, seen from below]

Size 210.8 x 166.04 mm. Coordinates in mm from the lower left corner, seen from the top.
Outline: 0,0 210.8,0 210.8,166.04 0,166.04 0,0
Copper layers (1*16): Top 0.035mm / dielectric 1.5mm / Bottom 0.035mm
Design rules "default": minimum track width 6mil, minimum drill 0.35mm, track to track 6mil, track to pad 6mil, pad to pad 6mil, via to via 6mil, smd to smd 6mil, copper to edge 40mil, drill to drill 6mil, minimum pad ring 10mil, minimum via ring 8mil, stop-mask expansion 4mil, vias tented up to drill 0mil, thermal gap 10mil
Milling: area 26.7,12.7 to 44.5,61

### Footprints (pad centres in the part's own frame; a part is rotated, then mirrored left to right if it is on the bottom)
_CUSTOM_PARTS_LF_885 = smd 5.6 x 7.23: P$1 5.25,0; P$2 -5.25,0
3568 = drill 1.6 square: L1 0,3.4; L2 0,0; R1 9.94,3.4; R2 9.92,0
C0805 = smd 1.3 x 1.5: 1 -0.95,0; 2 0.95,0
CERALINK_FA3 = smd 2.85 x 10: P$1 -3.925,0; P$2 3.925,0
E7,5-16 = drill 1.016 pad 3.15: + -3.81,0 | drill 1.016 pad 3.15 octagon: - 3.81,0
DO41-10 = drill 1.118: A 5.08,0; C -5.08,0
ZDIO12.5 = drill 0.813 long: A 6.223,0; C -6.35,0
VICOR_CHIP_HEATSINK = drill 1.52 pad 1.77: EN -23.19,-1.38; FT -23.19,-4.13; TR -23.19,1.38 | drill 2.03 pad 2.28: IN+ -23.19,8; IN- -23.19,-8 | drill 2.03 pad 2.41: OUT+_1 23.19,8.25; OUT+_2 23.19,-2.75; OUT-_1 23.19,2.75; OUT-_2 23.19,-8.25 | hole 3.1: -16.47,13.97; -16.47,-13.97; 16.47,13.97; 16.47,-13.97
3,3 = hole 3.3: 0,0
DIP08 = drill 0.813 pad 1.626: 1 -3.81,-3.81; 2 -1.27,-3.81; 3 1.27,-3.81; 4 3.81,-3.81; 5 3.81,3.81; 6 1.27,3.81; 7 -1.27,3.81; 8 -3.81,3.81
L_1510_NONSTANDARD = smd 3.15 x 12.5: P$1 -7.675,0; P$2 7.675,0
DIL04 = drill 0.813 offset: 1 -1.27,-3.81; 2 1.27,-3.81; 3 1.27,3.81; 4 -1.27,3.81
R0805:1 = smd 1.3 x 1.5: 1 -0.95,0; 2 0.95,0
R0805 = smd 1.3 x 1.5: 1 -0.95,0; 2 0.95,0
R2010 = smd 1.8 x 2.7: 1 -2.2,0; 2 2.2,0
TO-247-2V = drill 2 pad 4: 1 -5.08,0; 2 5.08,0
G7L = drill 3.3 square: 0 0,0; 1 36.8,0; 2 0,-17.7; 4 11.2,-17.7; 6 25.6,-17.7; 8 36.8,-17.7
HSA_25_FOOT = hole 3.3: 34.65,23.9; 16.35,4.1
_CUSTOM_TO-247-2V = drill 2 pad 4: 1 -5.08,-1.905; 2 5.08,-1.905 | drill 2.54 pad 4.318 octagon: P$1 -12.5,0; P$2 12.5,0
1777587_FOOT = drill 1.3 octagon: P$1 0,0; P$2 5,0; P$3 10,0; P$4 15,0; P$5 20,0; P$6 25,0
1725724_FOOT = drill 1.1 octagon: P$1 0,0; P$2 2.54,0; P$3 5.08,0; P$4 7.62,0; P$5 10.16,0; P$6 12.7,0; P$7 15.24,0; P$8 17.78,0; P$9 20.32,0
SOT23 = smd 1 x 1.4: 1 -0.95,-1.1; 2 0.95,-1.1; 3 0,1.1
1777600_FOOT = drill 1.3 pad 3 octagon: P$1 0,0; P$2 6.35,-9; P$3 12.7,0; P$4 19.05,-9; P$5 25.4,0; P$6 31.75,-9; P$7 38.1,0; P$8 44.45,-9
TO220 = drill 1.118 long: 1 -2.54,-6.35; 2 0,-6.35; 3 2.54,-6.35 | hole 3.302: 0,11.176
PDM_2019_REVB_MIC4416YM4-TR = smd 1 x 1.44: CTL 0,0; GATE 1.9,-2.2; VS 1.9,0 | smd 1.2 x 1.44: GND 0.2,-2.2
DCDC_PARTS_282838-2_FOOT = drill 1.1 octagon: P$1 0,0; P$2 10,0
SOT23-5L = smd 0.55 x 1.2: 1 -0.95,-1.3; 2 0,-1.3; 3 0.95,-1.3; 4 0.95,1.3; 5 -0.95,1.3
TO228P991X238-3 = smd 1.718 x 0.974: 1 -4.704,2.28; 2 -4.704,-2.28 | smd 7.001 x 5.544: 3 2.063,0
_CUSTOM_111_CUSTOM_TRANS_SIRA90DP-T1-GE3 = smd 0.41 x 0.72: 1 -1.905,-2.715; 2 -0.635,-2.715; 3 0.635,-2.715; 4 1.905,-2.715 | smd 5.588 x 4.064: 5 0,1.08
1777642_FOOTPRINT = drill 1.3 square: P$1 0,0; P$2 6.35,-9; P$3 12.7,0; P$4 19.05,-9; P$5 25.4,0; P$6 31.75,-9; P$7 38.1,0; P$8 44.45,-9; P$9 50.8,0; P$10 57.15,-9; P$11 63.5,0; P$12 69.85,-9
FUSE_HOLDER = drill 5.3: P$1 -15.01,0; P$2 15.01,0
DE_12X2_PIN_HEADER = drill 1.1 pad 2 square: 1A 17.02,4.39; 1B -17.02,-1.96; 2A 21.21,4.39; 2B -21.21,-1.96; 3A 25.4,4.39; 3B -25.4,-1.96; 4A 29.59,4.39; 4B -29.59,-1.96; 5A 33.78,4.39; 5B -33.78,-1.96; 6A 37.97,4.39; 6B -37.97,-1.96; 7A 37.97,-1.96; 7B -37.97,4.39; 8A 33.78,-1.96; 8B -33.78,4.39; 9A 29.59,-1.96; 9B -29.59,4.39; 10A 25.4,-1.96; 10B -25.4,4.39; 11A 21.21,-1.96; 11B -21.21,4.39; 12A 17.02,-1.96; 12B -17.02,4.39 | hole 3: 0,0
SR4M4012_FOOT = drill 1.3 pad 2 square: COIL+ 0,7.6; COIL- 0,0; NCA4 18.05,0; NCB4 23.05,0; NOA1 18.05,7.6; NOA2 29.55,7.6; NOA3 29.55,0; NOB1 23.05,7.6; NOB2 34.55,7.6; NOB3 34.55,0
GV224 = drill 16.256: A1 -13.335,19.05; A2 13.335,19.05 | drill 7.62: NC1 0,39.37 | drill 0.889: T1 -8.382,37.846; T2 8.382,37.846 | drill 0.889 pad 1.524: X1 -4.064,0; X2 4.064,0
1751248 = drill 1.1 pad 1.7: 1 -1.75,-0.1; 2 1.75,-0.1

### Placement (x,y rotation side)
1A_500V_FUSE_ENERGYMETER  -39.37,88.9 0 top  (outside the outline)
1A_500V_FUSE_IMD_VSENSE  -71.12,88.9 0 top  (outside the outline)
AMS  -99.06,-127 0 top  (outside the outline)
C1  -52.07,125.73 0 top  (outside the outline)
C2  -57.15,125.73 0 top  (outside the outline)
C3  -67.31,118.11 0 top  (outside the outline)
C4  -21.59,125.73 0 top  (outside the outline)
C5  -26.67,125.73 0 top  (outside the outline)
CFILTER_1  -26.67,-16.51 0 top  (outside the outline)
CFILTER_2  -96.52,-49.53 0 top  (outside the outline)
COUT_EXT  -78.74,-48.26 0 top  (outside the outline)
D1  -87.63,110.49 0 top  (outside the outline)
D2  -93.98,-3.81 0 top  (outside the outline)
D4  -19.05,118.11 0 top  (outside the outline)
DCM290P138T600A40  -77.47,-24.13 0 top  (outside the outline)
DISCH  -82.55,-127 0 top  (outside the outline)
H1  -82.55,-80.01 0 top  (outside the outline)
H2  -73.66,-80.01 0 top  (outside the outline)
H3  -64.77,-80.01 0 top  (outside the outline)
H4  -55.88,-80.01 0 top  (outside the outline)
HV+_FUSE_DRY  -33.02,100.33 0 top  (outside the outline)
IC1  -48.26,100.33 0 top  (outside the outline)
IMD  -66.04,-127 0 top  (outside the outline)
INPUT_FUSE  -43.18,-64.77 0 top  (outside the outline)
L_IN  -41.91,-19.05 0 top  (outside the outline)
MONITOR  -49.53,-127 0 top  (outside the outline)
OK3  -53.34,64.77 0 top  (outside the outline)
R1  -90.17,118.11 0 top  (outside the outline)
R2  -31.75,125.73 0 top  (outside the outline)
R3  -95.25,118.11 0 top  (outside the outline)
R4  -36.83,125.73 0 top  (outside the outline)
R5  -100.33,118.11 0 top  (outside the outline)
R6  -41.91,125.73 0 top  (outside the outline)
R7  -16.51,125.73 0 top  (outside the outline)
R8  -46.99,125.73 0 top  (outside the outline)
R9  -60.96,118.11 0 top  (outside the outline)
R10  -54.61,118.11 0 top  (outside the outline)
R11  -85.09,118.11 0 top  (outside the outline)
R12  -83.82,-132.08 0 top  (outside the outline)
R13  -77.47,-132.08 0 top  (outside the outline)
R14  -71.12,-132.08 0 top  (outside the outline)
R15  -64.77,-132.08 0 top  (outside the outline)
R16  -77.47,110.49 0 top  (outside the outline)
R17  -73.66,118.11 0 top  (outside the outline)
R19  -80.01,118.11 0 top  (outside the outline)
R_IN  -25.4,-64.77 0 top  (outside the outline)
SPR1  -33.02,-127 0 top  (outside the outline)
SPR2  -99.06,-134.62 0 top  (outside the outline)
U$1  193.04,11.43 180 top
U$2  -60.96,1.27 0 top  (outside the outline)
U$3  -64.77,30.48 0 top  (outside the outline)
U$4  125.73,25.4 90 top
U$5  -48.26,-80.01 0 top  (outside the outline)
U$6  -99.06,-90.17 0 top  (outside the outline)
U$7  -48.26,118.11 0 top  (outside the outline)
U$8  -31.75,-116.84 0 top  (outside the outline)
U$9  -99.06,-60.96 0 top  (outside the outline)
U$10  -71.12,38.1 0 top  (outside the outline)
U$11  -82.55,38.1 0 top  (outside the outline)
U$12  -93.98,38.1 0 top  (outside the outline)
U$13  -19.05,67.31 0 top  (outside the outline)
U$14  -30.48,67.31 0 top  (outside the outline)
U$15  -62.23,125.73 0 top  (outside the outline)
U$16  -25.4,110.49 0 top  (outside the outline)
U$17  -40.64,110.49 0 top  (outside the outline)
U$18  -52.07,-116.84 0 top  (outside the outline)
U$19  -82.55,64.77 0 top  (outside the outline)
U$20  -97.79,-99.06 0 top  (outside the outline)
U$21  -97.79,-107.95 0 top  (outside the outline)
U$22  -97.79,-116.84 0 top  (outside the outline)
U$23  -99.06,-312.42 0 top  (outside the outline)
U$24  15.24,109.22 90 top
U$25  -99.06,-326.39 0 top  (outside the outline)
U$26  -60.96,-304.8 0 top  (outside the outline)
U$27  -97.79,-347.98 0 top  (outside the outline)
U$28  -55.88,-347.98 0 top  (outside the outline)
U$29  -97.79,-361.95 0 top  (outside the outline)
U$30  -55.88,-361.95 0 top  (outside the outline)
U$31  78.74,16.51 0 top
U$32  196.85,73.66 90 top
U$33  15.24,36.83 90 top
U$34  135.89,96.52 270 top
U$35  76.2,82.55 180 top
X1  -95.25,-81.28 0 top  (outside the outline)

### Tracks (layer width: path | path; a pad name or v marks a point on that pad's centre or on a via)
+12V  (40 unrouted)
ACC_LGHT  (1 unrouted)
AIR_ON  (6 unrouted)
AMS+  (2 unrouted)
CH1IN  (4 unrouted)
CH2IN  (4 unrouted)
DCDC_OUT  (12 unrouted)
DISCHPWR  (2 unrouted)
GND  (41 unrouted)
  Top 2.54: U$1.0 203.2,11.43 208.51,16.74 208.51,93.75 198.12,104.14 143.51,104.14 U$34.0
HV+_DRY_FUSED  (1 unrouted)
HV+_WET
  Top 2.54: U$35.2 71.12,67.31 65.41,61.59 U$31.A1
IMD+  (2 unrouted)
MON+  (2 unrouted)
N$1  (1 unrouted)
N$2  (2 unrouted)
N$3  (1 unrouted)
N$4  (1 unrouted)
N$5  (2 unrouted)
N$6  (1 unrouted)
N$7  (1 unrouted)
N$8  (2 unrouted)
N$9  (3 unrouted)
N$10  (1 unrouted)
N$11  (2 unrouted)
N$12  (4 unrouted)
N$13  (1 unrouted)
N$14  (2 unrouted)
N$15  (2 unrouted)
N$16  (1 unrouted)
N$17  (1 unrouted)
N$18  (1 unrouted)
N$19  (1 unrouted)
N$20  (4 unrouted)
N$21
  Top 2.54: U$34.8 106.02,59.72 U$35.1
N$22  (1 unrouted)
N$23
  Top 2.54: U$34.6 U$34.4
N$24
  Top 2.54: U$1.1 161.32,16.51 200.66,16.51 204.47,20.32 204.47,59.69 196.75,67.41 195.94,67.41 194.67,68.69 194.67,69.49 190.5,73.66 167.39,73.66 U$32.T1
N$25  (1 unrouted)
N$26  (2 unrouted)
N$27  (1 unrouted)
  Bottom 2.54: U$31.X2 82.8,11.18 91.69,2.29 204.22,2.29 208.51,6.58 208.51,62 200.66,69.85 196.85,69.85
N$30
  Top 2.54: U$1.6 U$1.4
N$31
  Top 2.54: U$4.1 136.44,29.13 U$1.8 156.21,29.16 156.21,29.21
NO1A  (2 unrouted)
NO1B  (2 unrouted)
NO2A  (2 unrouted)
NO2B  (2 unrouted)
NO3A  (2 unrouted)
NO3B  (2 unrouted)
NO4A  (2 unrouted)
NO4B  (2 unrouted)
NO5A  (2 unrouted)
NO5B  (2 unrouted)
NO6A  (2 unrouted)
NO6B  (2 unrouted)
PRECH_ACTIVE  (3 unrouted)
RST1IN  (3 unrouted)
RST2IN  (3 unrouted)
SPR1PWR  (2 unrouted)
SPR2PWR  (2 unrouted)
TSAL_GRN_GND  (3 unrouted)
TSAL_RED_GND  (1 unrouted)
V+  (3 unrouted)
  Top 2.54: U$31.A2 124.46,67.94 124.46,90.25 U$34.2 | 99.38,42.86 U$31.A2 | U$4.2 122.56,35.56 U$31.A2
V+_FUSED  (2 unrouted)
V-  (7 unrouted)
  Top 2.54: U$32.A1 193.04,45.09 U$1.2
(copper drawn outside any net)
  shapes: Top area x3